# Altium schematic sheet Sheet9.SchDoc
size A4; SheetNumber: 1; SheetTotal: 1
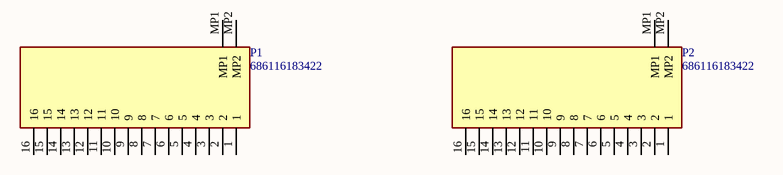
[diagram p0: Sheet9.SchDoc]

## Parts
P1  686116183422  [686116183422]
P2  686116183422  [686116183422]

## Nets

Not connected (* = marked no-connect by the designer): P1 1 2 3 4 5 6 7 8 9 10 11 12 13 14 15 16 MP1 MP2; P2 1 2 3 4 5 6 7 8 9 10 11 12 13 14 15 16 MP1 MP2

## Library data of the parts
P1 P2 = 686116183422: Wurth Elektronik WR-FPC Series 1mm Pitch 16 Way Horizontal SMT Female FPC Connector, Top Contact; Geometry.Height: 1.3mm; Mouser Part Number: 710-686116183422; Mouser Price/Stock: https://www.mouser.co.uk/ProductDetail/Wurth-Elektronik/686116183422?qs=5aG0NVq1C4zMCTkNAYvBmg%3D%3D; Manufacturer_Name: Wurth Elektronik; Manufacturer_Part_Number: 686116183422; Datasheet Link: https://componentsearchengine.com/Datasheets/1/686116183422.pdf